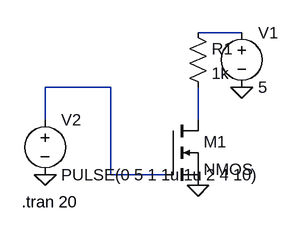
[diagram p0: schematic Nmos_invert.asc]
Nmos_invert.asc, the LTspice schematic file:
Version 4
SHEET 1 880 680
WIRE 304 32 240 32
WIRE 112 112 16 112
WIRE 16 160 16 112
WIRE 240 160 240 112
WIRE 112 240 112 112
WIRE 192 240 112 240
FLAG 240 256 0
FLAG 16 240 0
FLAG 304 112 0
SYMBOL nmos 192 160 R0
SYMATTR InstName M1
SYMBOL voltage 304 16 R0
WINDOW 123 0 0 Left 0
WINDOW 39 0 0 Left 0
SYMATTR InstName V1
SYMATTR Value 5
SYMBOL voltage 16 144 R0
WINDOW 123 0 0 Left 0
WINDOW 39 0 0 Left 0
SYMATTR InstName V2
SYMATTR Value PULSE(0 5 1 1u 1u 2 4 10)
SYMBOL res 224 16 R0
SYMATTR InstName R1
SYMATTR Value 1k
TEXT -18 280 Left 2 !.tran 20

The netlist it stands for:
* Nmos_invert.asc
M1 N003 N002 0 0 NMOS
V1 N001 0 5
V2 N002 0 PULSE(0 5 1 1u 1u 2 4 10)
R1 N001 N003 1k
.model NMOS NMOS
.model PMOS PMOS
.lib standard.mos
.tran 20
.backanno
.end